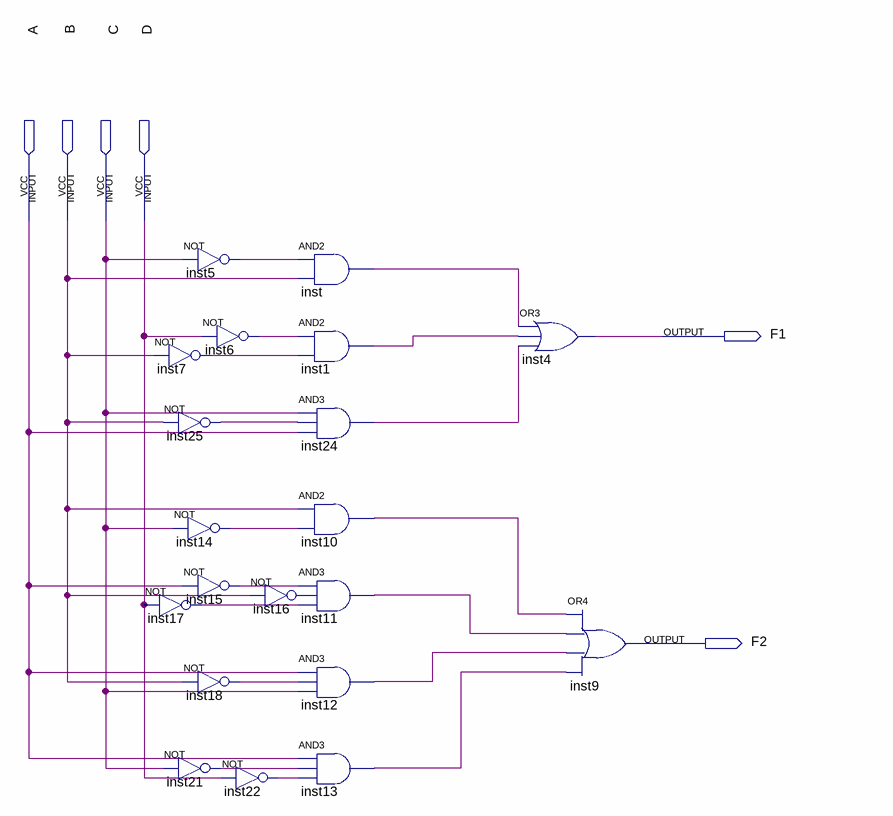
[diagram p0: schematic sheet]
// Quartus schematic HW3P4.bdf as structural Verilog: 20 symbols, 6 pins
module HW3P4 (
  input  A,
  input  B,
  input  C,
  input  D,
  output F1,
  output F2
);

  wire inst1_out, inst5_out, inst6_out, inst7_out, inst10_out, inst11_out, inst12_out, inst13_out,
       inst14_out, inst15_out, inst16_out, inst17_out, inst18_out, inst21_out, inst22_out, inst24_out,
       inst25_out, inst_out;

  not inst7 (inst7_out, B);
  not inst17 (inst17_out, D);
  not inst5 (inst5_out, C);
  not inst6 (inst6_out, D);
  not inst25 (inst25_out, B);
  not inst14 (inst14_out, C);
  not inst15 (inst15_out, A);
  not inst18 (inst18_out, B);
  not inst21 (inst21_out, C);
  not inst22 (inst22_out, D);
  and inst (inst_out, inst5_out, B);
  and inst1 (inst1_out, inst6_out, inst7_out);
  and inst24 (inst24_out, C, inst25_out, A);
  and inst10 (inst10_out, B, inst14_out);
  and inst11 (inst11_out, inst15_out, inst16_out, inst17_out);
  not inst16 (inst16_out, B);
  and inst12 (inst12_out, A, inst18_out, C);
  and inst13 (inst13_out, A, inst21_out, inst22_out);
  or inst4 (F1, inst_out, inst1_out, inst24_out);
  or inst9 (F2, inst10_out, inst11_out, inst12_out, inst13_out);
endmodule
